# Altium schematic sheet PowerSupply-SCH_SH2_(02).SchDoc: SCHEMATIC
size 863 x 558 mm; DocumentNumber: NIR-Spec-2; SheetNumber: 2; SheetTotal: 2; PageSetup: Record=PageOptions|CenterHorizontal=True|CenterVertical=True|PrintScale=0.98|XCorrection=1.00|YCorrection=1.00|PrintKind=2|BorderSize=5000000|LeftOffset=0|BottomOffset=0|Orientation=2|PaperLength=1000|PaperWidth=1000|Scale=100|PaperSource=15|PrintQuality=1200|MediaType=1|DitherType=10|PaperKind=11 x 17|PrintScaleMode=1
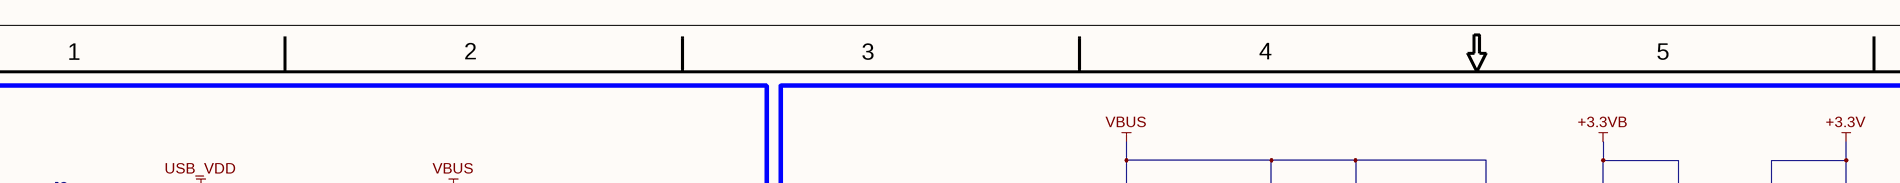
[diagram p0: PowerSupply-SCH_SH2_(02).SchDoc, top left]
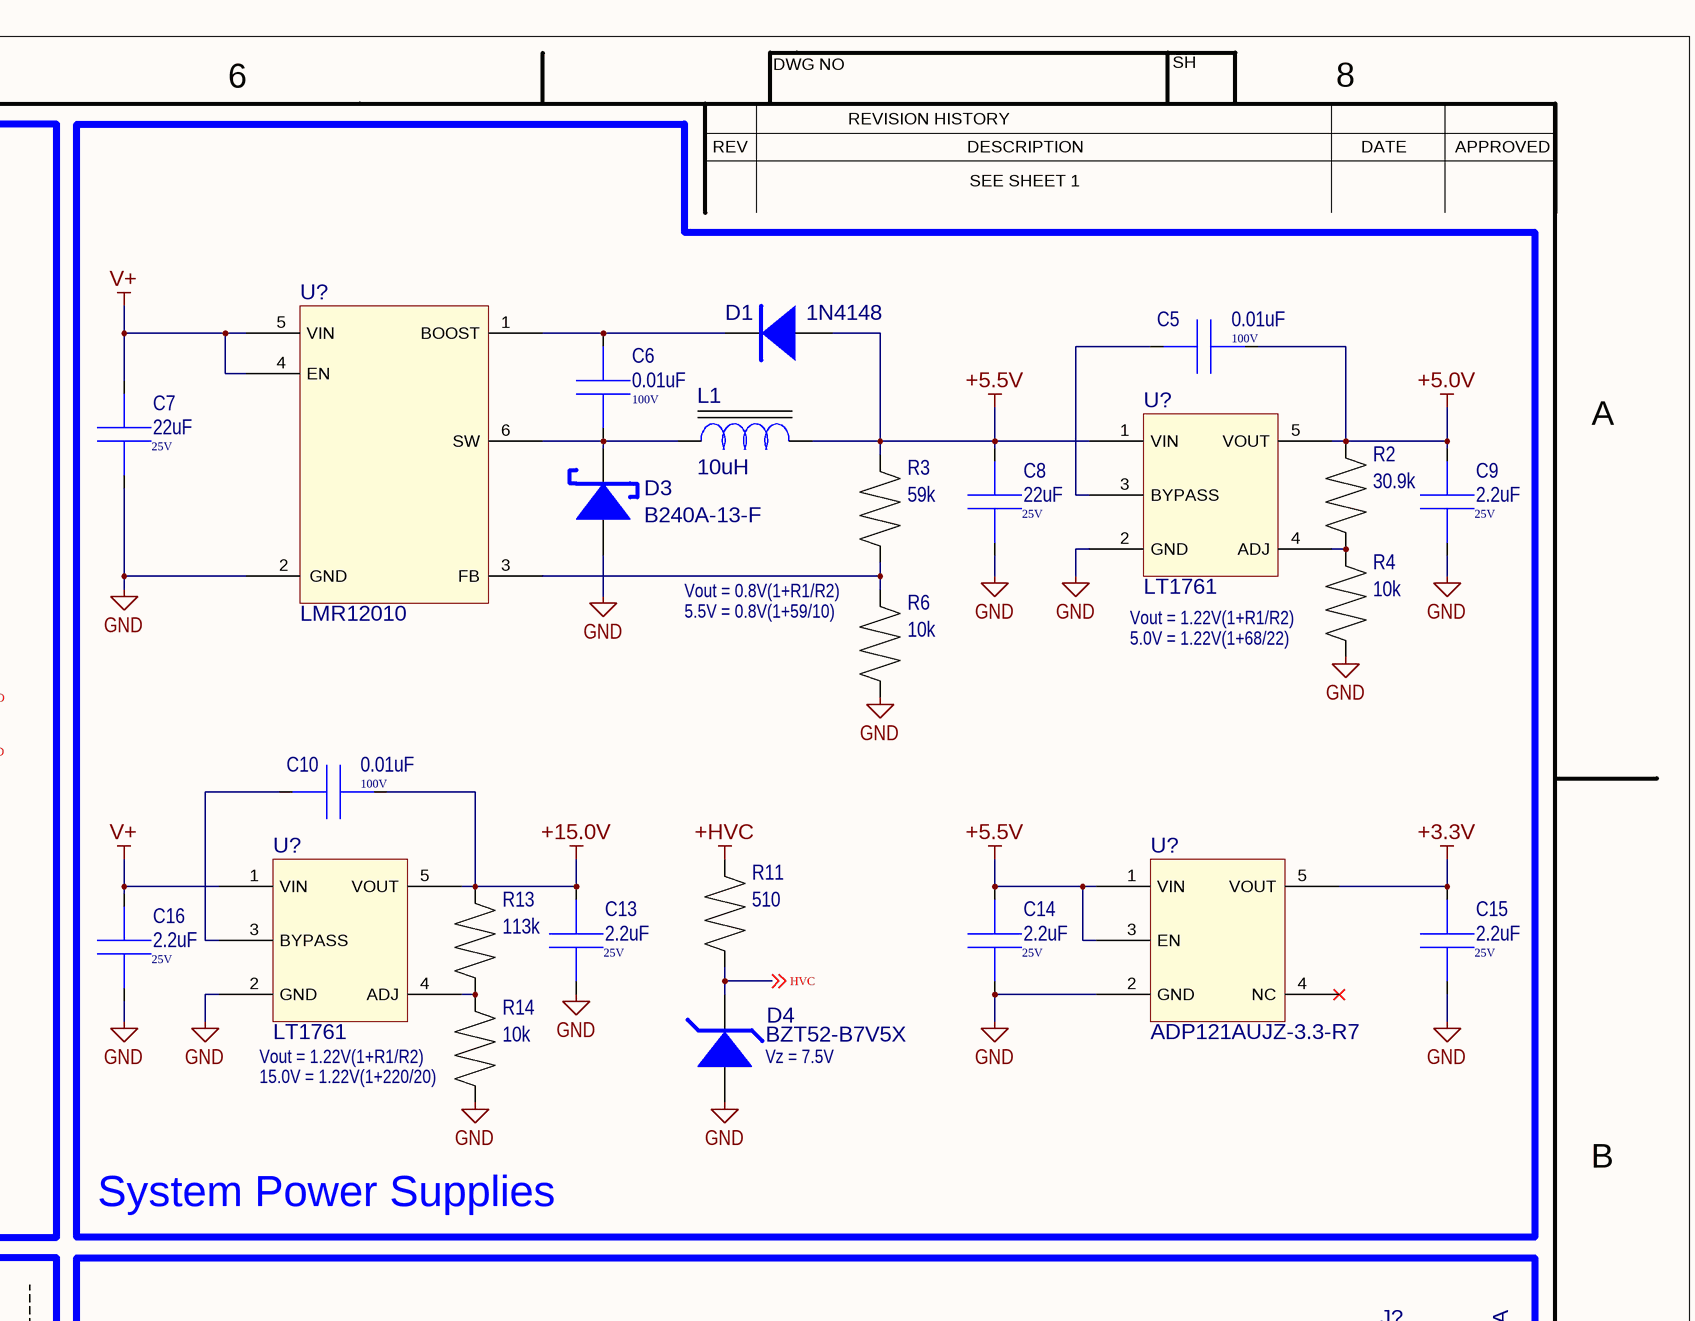
[diagram p1: PowerSupply-SCH_SH2_(02).SchDoc, top right]
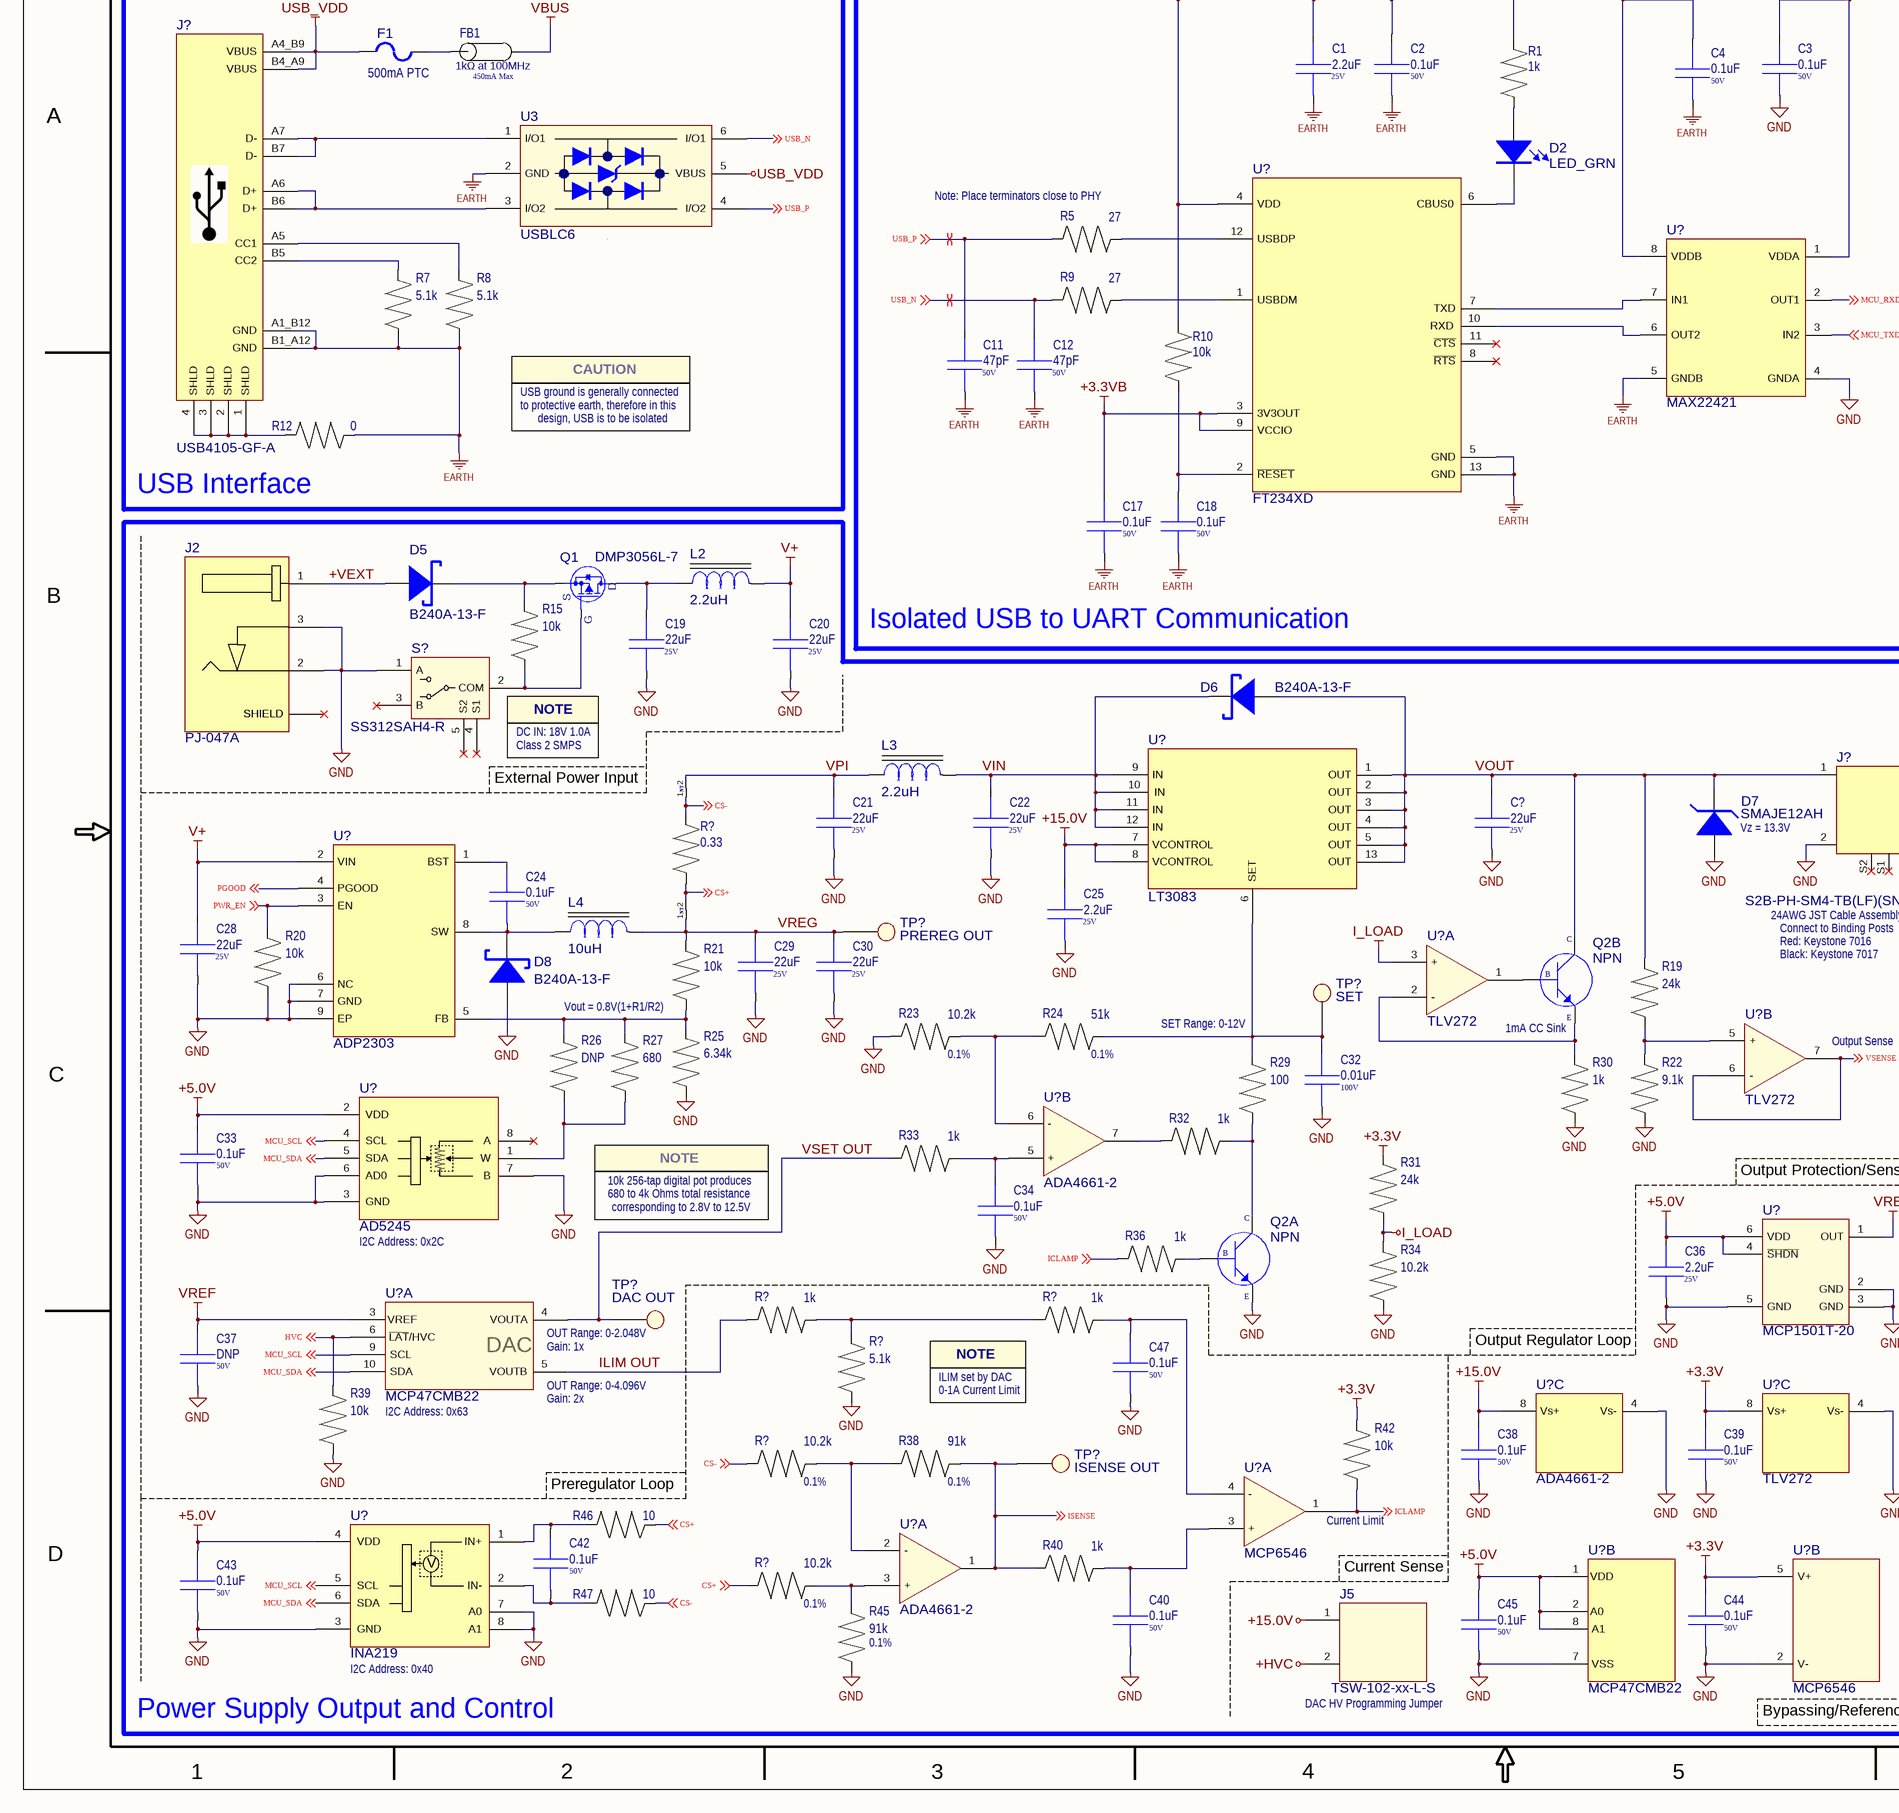
[diagram p2: PowerSupply-SCH_SH2_(02).SchDoc, bottom left]
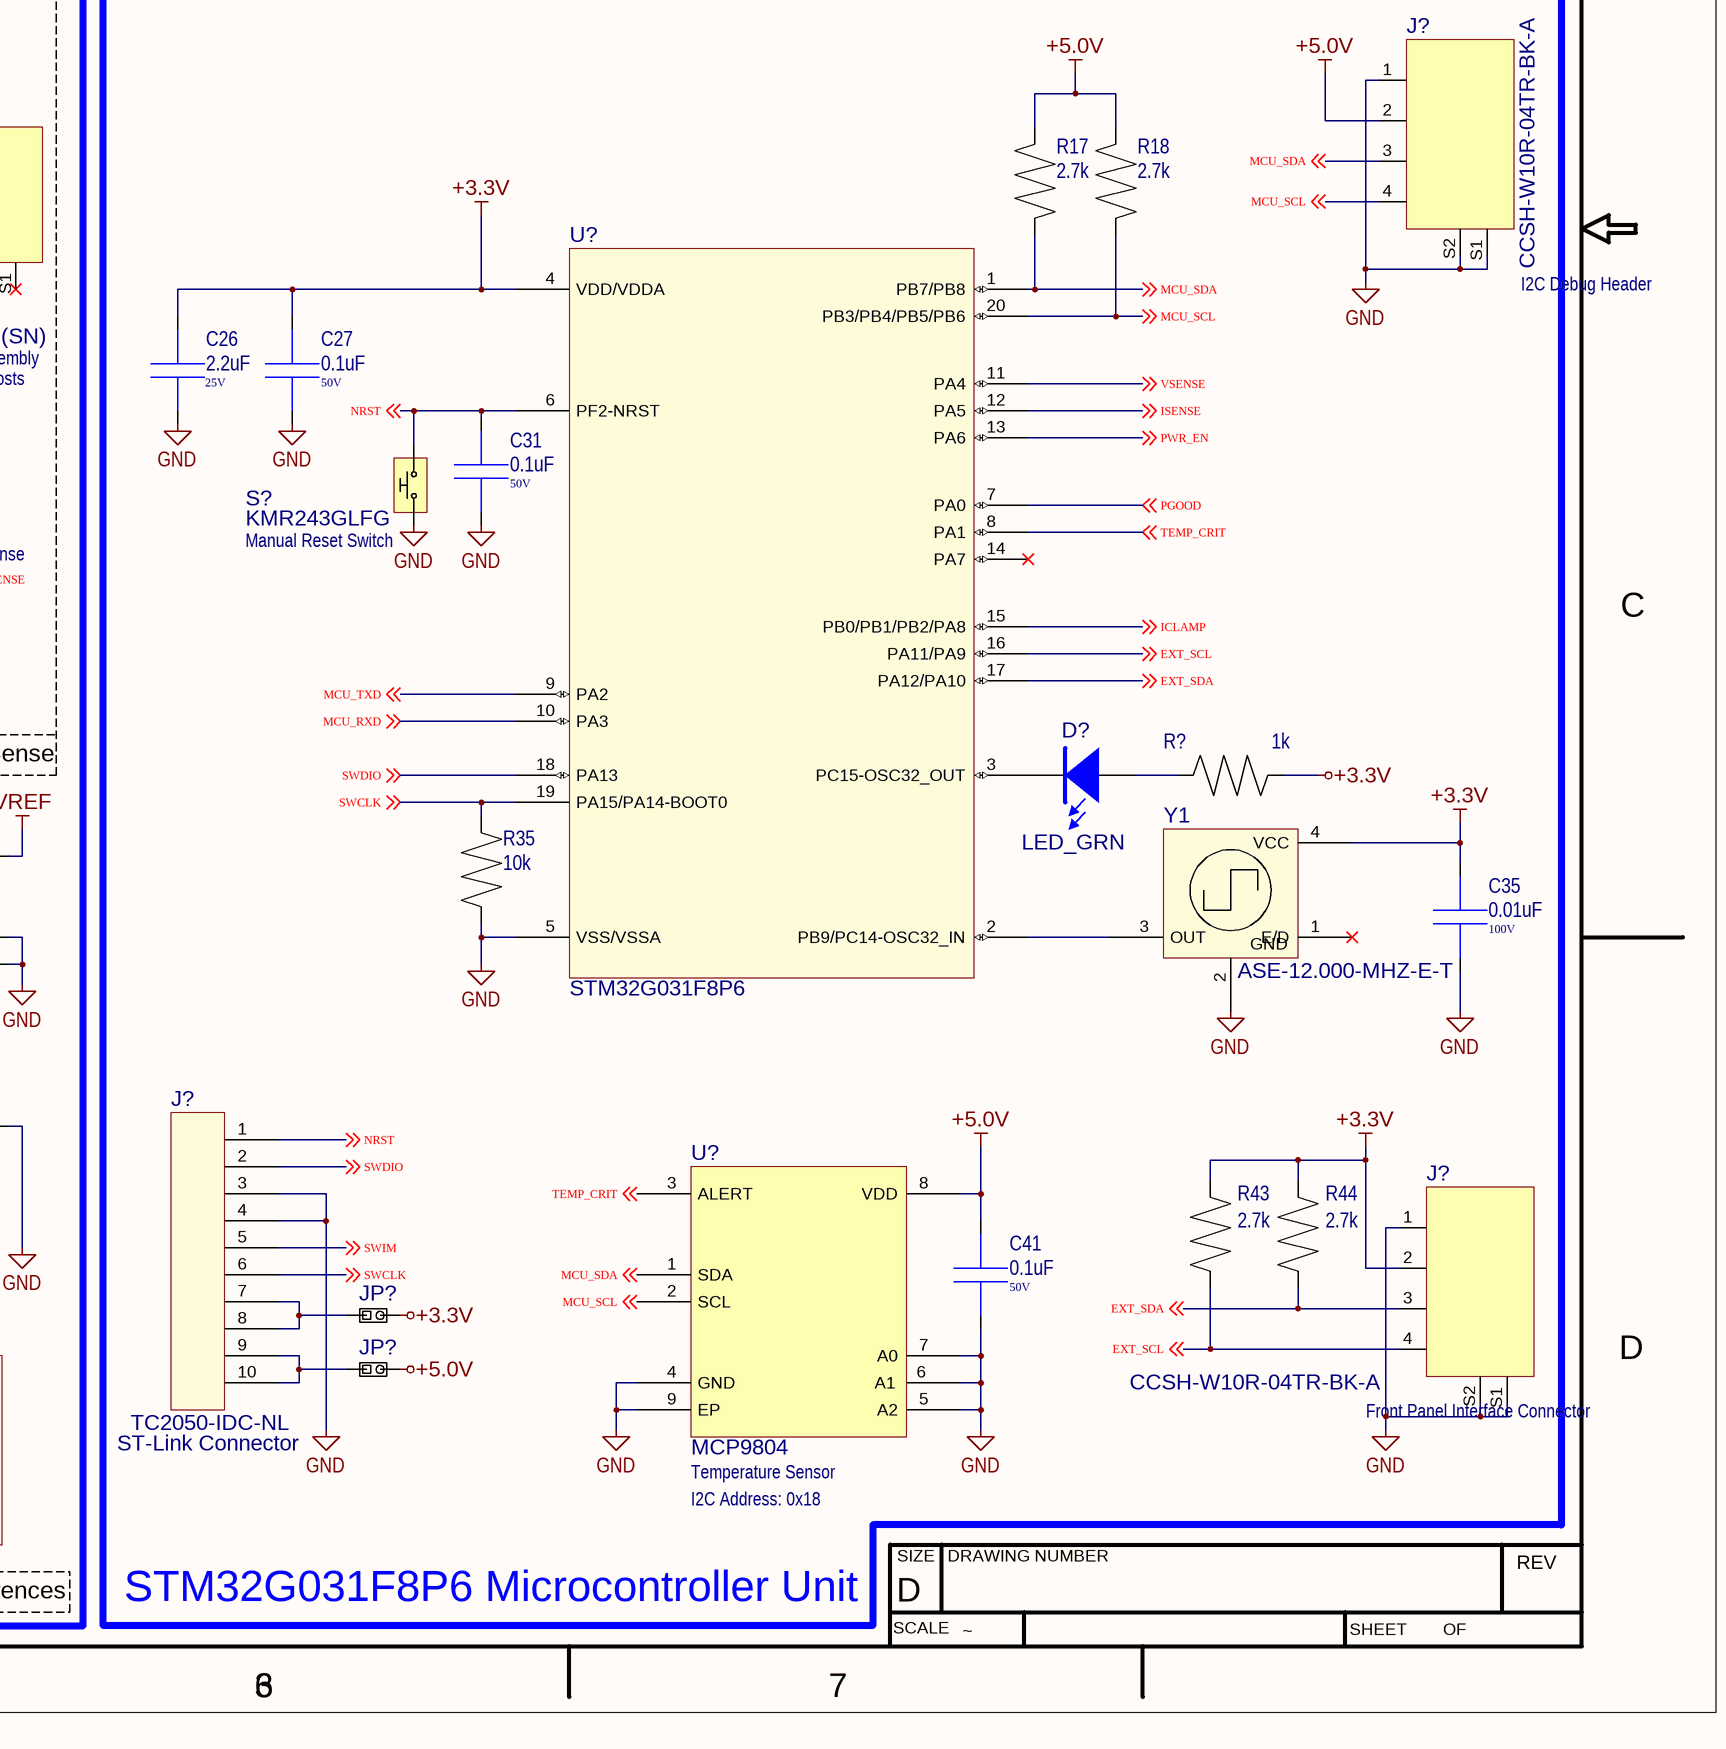
[diagram p3: PowerSupply-SCH_SH2_(02).SchDoc, bottom right]

## Parts
(Parts that share a designator on the sheet are numbered #1, #2 ... from top to bottom, then left to right.)
C1  2.2uF  Voltage: 25V  [0402]
C2  0.1uF  Voltage: 50V  [0402]
C3  0.1uF  Voltage: 50V  [0402]
C4  0.1uF  Voltage: 50V  [0402]
C5  0.01uF  Voltage: 100V  [0402]
C6  0.01uF  Voltage: 100V  [0402]
C7  22uF  Voltage: 25V  [0805]
C8  22uF  Voltage: 25V  [0805]
C9  2.2uF  Voltage: 25V  [0402]
C10  0.01uF  Voltage: 100V  [0402]
C11  47pF  Voltage: 50V  [0402]
C12  47pF  Voltage: 50V  [0402]
C13  2.2uF  Voltage: 25V  [0402]
C14  2.2uF  Voltage: 25V  [0402]
C15  2.2uF  Voltage: 25V  [0402]
C16  2.2uF  Voltage: 25V  [0402]
C17  0.1uF  Voltage: 50V  [0402]
C18  0.1uF  Voltage: 50V  [0402]
C19  22uF  Voltage: 25V  [0805]
C20  22uF  Voltage: 25V  [0805]
C21  22uF  Voltage: 25V  [0805]
C22  22uF  Voltage: 25V  [0805]
C24  0.1uF  Voltage: 50V  [0402]
C25  2.2uF  Voltage: 25V  [0402]
C26  2.2uF  Voltage: 25V  [0402]
C27  0.1uF  Voltage: 50V  [0402]
C28  22uF  Voltage: 25V  [0805]
C29  22uF  Voltage: 25V  [0805]
C30  22uF  Voltage: 25V  [0805]
C31  0.1uF  Voltage: 50V  [0402]
C32  0.01uF  Voltage: 100V  [0402]
C33  0.1uF  Voltage: 50V  [0402]
C34  0.1uF  Voltage: 50V  [0402]
C35  0.01uF  Voltage: 100V  [0402]
C36  2.2uF  Voltage: 25V  [0402]
C37  DNP  Voltage: 50V  [0402]
C38  0.1uF  Voltage: 50V  [0402]
C39  0.1uF  Voltage: 50V  [0402]
C40  0.1uF  Voltage: 50V  [0402]
C41  0.1uF  Voltage: 50V  [0402]
C42  0.1uF  Voltage: 50V  [0402]
C43  0.1uF  Voltage: 50V  [0402]
C44  0.1uF  Voltage: 50V  [0402]
C45  0.1uF  Voltage: 50V  [0402]
C47  0.1uF  Voltage: 50V  [0402]
C?  22uF  Voltage: 25V  [0805]
D1  1N4148  [SOD-323]
D2  LED_GRN  [0603_LED_Red]
D3  B240A-13-F  [SMA]
D4  BZT52-B7V5X  [SOD-123]
D5  B240A-13-F  [SMA]
D6  B240A-13-F  [SMA]
D7  SMAJE12AH  [SMA]
D8  B240A-13-F  [SMA]
D?  LED_GRN  [0603_LED_Red]
F1  500mA PTC  [0603]
FB1  Rated Current: 450mA Max  Impedance: 1kΩ at 100MHz  [0603]  (hidden comment: Ferrite_Bead)
J2  PJ-047A  [PJ-047A]
J5  TSW-102-xx-L-S  [TSW-102-xx-L-S]
J?#1  USB4105-GF-A  [USB4105-GF-A]
J?#2  CCSH-W10R-04TR-BK-A  [CCSH-W10R-04TR-BK-A]
J?#3  S2B-PH-SM4-TB(LF)(SN)  [S2B-PH-SM4-TB(LF)(SN)]
J?#4  TC2050-IDC-NL  [TC2050-IDC-NL-FP]  (no BOM)
J?#5  CCSH-W10R-04TR-BK-A  [CCSH-W10R-04TR-BK-A]
JP?#1  Solder Jumper  [SOLDER JUMPER]  (value not drawn)  (no BOM)
JP?#2  Solder Jumper  [SOLDER JUMPER]  (value not drawn)  (no BOM)
L1  10uH  [XFL4020-xxxMEx]
L2  2.2uH  [0806AZ]
L3  2.2uH  [0806AZ]
L4  10uH  [WURTH_WE-LHMI]
NT?#1  NT  [NETTIE]  (value not drawn)  (net tie, no BOM)
NT?#2  NT  [NETTIE]  (value not drawn)  (net tie, no BOM)
Q1  DMP3056L-7  [SOT-23]
Q2  NPN  [SOT-666]  (parts A,B of 2)
R1  1k  [0402]
R2  30.9k  [0402]
R3  59k  [0402]
R4  10k  [0402]
R5  27  [0402]
R6  10k  [0402]
R7  5.1k  [0402]
R8  5.1k  [0402]
R9  27  [0402]
R10  10k  [0402]
R11  510  [0603]
R12  0  [0402]
R13  113k  [0402]
R14  10k  [0402]
R15  10k  [0402]
R17  2.7k  [0402]
R18  2.7k  [0402]
R19  24k  [0402]
R20  10k  [0402]
R21  10k  [0402]
R22  9.1k  [0402]
R23  10.2k  [0402]
R24  51k  [0402]
R25  6.34k  [0402]
R26  DNP  [0402]
R27  680  [0402]
R29  100  [0402]
R30  1k  [0402]
R31  24k  [0402]
R32  1k  [0402]
R33  1k  [0402]
R34  10.2k  [0402]
R35  10k  [0402]
R36  1k  [0402]
R38  91k  [0402]
R39  10k  [0402]
R40  1k  [0402]
R42  10k  [0402]
R43  2.7k  [0402]
R44  2.7k  [0402]
R45  91k  [0402]
R46  10  [0402]
R47  10  [0402]
R?#1  0.33  [1206]
R?#2  1k  [0402]
R?#3  1k  [0402]
R?#4  1k  [0402]
R?#5  5.1k  [0402]
R?#6  10.2k  [0402]
R?#7  10.2k  [0402]
S?#1  SS312SAH4-R  [SW_SS312SAH4-R]
S?#2  KMR243GLFG  [KMR 2 Series]
TP?#1  PREREG OUT  [30-40 Drill]  (no BOM)
TP?#2  SET  [30-40 Drill]  (no BOM)
TP?#3  DAC OUT  [30-40 Drill]  (no BOM)
TP?#4  ISENSE OUT  [30-40 Drill]  (no BOM)
U3  USBLC6  [SOT-23-6_N]
U?#1  LT1761  [TSOT23-5]
U?#2  LMR12010  [TSOT-23-6]
U?#3  MAX22421  [SOIC-8]
U?#4  FT234XD  [DFN-12]
U?#5  LT1761  [TSOT23-5]
U?#6  ADP121AUJZ-3.3-R7  [TSOT23-5]
U?#7  LT3083  [DFN-12]
U?#8  ADP2303  [SOIC-8 EP]
U?#9  TLV272  [MSOP-8]  (part A of 3)
U?#10  TLV272  [MSOP-8]  (part B of 3)
U?#11  STM32G031F8P6  [TSSOP-20]
U?#12  AD5245  [TSOT-8]
U?#13  ADA4661-2  [MSOP-8]  (part B of 3)
U?#14  MCP1501T-20  [TSOT-23-6]
U?#15  MCP47CMB22  [MSOP-10]  (part A of 2)
U?#16  ADA4661-2  [MSOP-8]  (part C of 3)
U?#17  TLV272  [MSOP-8]  (part C of 3)
U?#18  MCP6546  [TSOT-23-5]  (part A of 2)
U?#19  MCP9804  [DFN-8_2x3]
U?#20  INA219  [SOIC-8]
U?#21  ADA4661-2  [MSOP-8]  (part A of 3)
U?#22  MCP47CMB22  [MSOP-10]  (part B of 2)
U?#23  MCP6546  [TSOT-23-5]  (part B of 2)
Y1  ASE-12.000-MHZ-E-T  [ASE-XXXXX-X-X-X]

## Blocks framed on the sheet
USB Interface: F1 FB1 J?#1 R7 R8 R12 U3
Isolated USB to UART Communication: C1-C4 C11 C12 C17 C18 D2 R1 R5 R9 R10 U?#3 U?#4
System Power Supplies: C5-C10 C13-C16 D1 D3 D4 L1 R2-R4 R6 R11 R13 R14 U?#1 U?#2 U?#5 U?#6
Power Supply Output and Control: C19-C22 C24 C25 C28-C30 C32-C34 C36-C40 C42-C45 C47 C? D5-D8 J2 J5 J?#3 L2-L4 NT?#1 NT?#2 Q1 Q2 R15 R19-R27 R29-R34 R36 R38-R40 R42 R45-R47 R?#1 R?#3-R?#7 S?#1 TP?#1-TP?#4 U?#7-U?#10 U?#12-U?#18 U?#20-U?#23
STM32G031F8P6 Microcontroller Unit: C26 C27 C31 C35 C41 D? J?#2 J?#4 J?#5 JP?#1 JP?#2 R17 R18 R35 R43 R44 R?#2 S?#2 U?#11 U?#19 Y1

## Nets
+3.3V: C3.2 C15.2 C26.2 C27.2 C35.2 C39.2 C44.2 J?#5.2 JP?#1.2 R31.2 R42.2 R43.2 R44.2 R?#2.2 U?#3.1(VDDA) U?#6.5(VOUT) U?#11.4(VDD/VDDA) U?#17.8(Vs+) U?#23.5(V+) Y1.4(VCC)
+3.3VB: C4.2 C17.2 U?#3.8(VDDB) U?#4.3(3V3OUT) U?#4.9(VCCIO)
+5.0V: C5.1 C9.2 C33.2 C36.2 C41.2 C43.2 C45.2 J?#2.2 JP?#2.2 R2.2 R17.2 R18.2 U?#1.5(VOUT) U?#12.2(VDD) U?#14.4(~{SHDN}) U?#14.6(VDD) U?#19.8(VDD) U?#20.4(VDD) U?#22.1(VDD) U?#22.2(A0) U?#22.8(A1)
+5.5V: C8.2 C14.2 D1.1(A) L1.2 R3.2 U?#1.1(VIN) U?#6.1(VIN) U?#6.3(EN)
+15.0V: C10.1 C13.2 C25.2 C38.2 J5.1 R13.2 U?#5.5(VOUT) U?#7.7(VCONTROL) U?#7.8(VCONTROL) U?#16.8(Vs+)
+HVC: J5.2 R11.2
EARTH: C1.1 C2.1 C4.1 C11.1 C12.1 C17.1 C18.1 J?#1.A1_B12(GND) J?#1.B1_A12(GND) R7.1 R8.1 R12.1 U3.2(GND) U?#3.5(GNDB) U?#4.5(GND) U?#4.13(GND)
GND: C3.1 C7.1 C8.1 C9.1 C13.1 C14.1 C15.1 C16.1 C19.1 C20.1 C21.1 C22.1 C25.1 C26.1 C27.1 C28.1 C29.1 C30.1 C31.1 C32.1 C33.1 C34.1 C35.1 C36.1 C37.1 C38.1 C39.1 C40.1 C41.1 C43.1 C44.1 C45.1 C47.1 C?.1 D3.1(A) D4.1(A) D7.1(A) D8.1(A) J2.2 J2.3 J?#2.1 J?#2.S1 J?#2.S2 J?#3.2 J?#4.3 J?#4.4 J?#5.1 J?#5.S1 J?#5.S2 Q2.1(E) R4.1 R6.1 R14.1 R20.1 R22.1 R23.1 R25.1 R30.1 R34.1 R35.2 R39.1 R45.1 R?#5.1 S?#1.1(A) S?#2.1 U?#1.2(GND) U?#2.2(GND) U?#3.4(GNDA) U?#5.2(GND) U?#6.2(GND) U?#8.6(NC) U?#8.7(GND) U?#8.9(EP) U?#11.5(VSS/VSSA) U?#12.3(GND) U?#12.6(AD0) U?#12.7(B) U?#14.2(GND) U?#14.3(GND) U?#14.5(GND) U?#16.4(Vs-) U?#17.4(Vs-) U?#19.4(GND) U?#19.5(A2) U?#19.6(A1) U?#19.7(A0) U?#19.9(EP) U?#20.3(GND) U?#20.7(A0) U?#20.8(A1) U?#22.7(VSS) U?#23.2(V-) Y1.2(GND)
I_LOAD: R31.1 R34.2 U?#9.3(+)
USB_VDD: F1.1 J?#1.A4_B9(VBUS) J?#1.B4_A9(VBUS) U3.5(VBUS)
V+: C7.2 C16.2 C20.2 C28.2 L2.2 U?#2.4(EN) U?#2.5(VIN) U?#5.1(VIN) U?#8.2(VIN)
VBUS: C1.2 C2.2 FB1.2 R1.2 R10.1 U?#4.4(VDD)
VREF: C37.2 U?#14.1(OUT) U?#15.3(VREF)
+VEXT: D5.1(A) J2.1
CS+: NT?#2.2 R46.1 R?#1.1 R?#7.1 ; off-sheet CS+
CS-: NT?#1.1 R47.1 R?#1.2 R?#6.1 ; off-sheet CS-
EXT_SCL: J?#5.4 R43.1 U?#11.16(PA11/PA9) ; off-sheet EXT_SCL
EXT_SDA: J?#5.3 R44.1 U?#11.17(PA12/PA10) ; off-sheet EXT_SDA
HVC: D4.2(K) R11.1 R39.2 U?#15.6(~{LAT}/HVC) ; off-sheet HVC
ICLAMP: R36.1 R42.1 U?#11.15(PB0/PB1/PB2/PA8) U?#18.1(OUT) ; off-sheet ICLAMP
ILIM OUT: R?#3.1 U?#15.5(VOUTB)
ISENSE: R38.2 R40.1 TP?#4.1 U?#11.12(PA5) U?#21.1(OUT) ; off-sheet ISENSE
MCU_RXD: U?#3.2(OUT1) U?#11.10(PA3) ; off-sheet MCU_RXD
MCU_SCL: J?#2.4 R18.1 U?#11.20(PB3/PB4/PB5/PB6) U?#12.4(SCL) U?#15.9(SCL) U?#19.2(SCL) U?#20.5(SCL) ; off-sheet MCU_SCL
MCU_SDA: J?#2.3 R17.1 U?#11.1(PB7/PB8) U?#12.5(SDA) U?#15.10(SDA) U?#19.1(SDA) U?#20.6(SDA) ; off-sheet MCU_SDA
MCU_TXD: U?#3.3(IN2) U?#11.9(PA2) ; off-sheet MCU_TXD
NRST: C31.2 J?#4.1 S?#2.2 U?#11.6(PF2-NRST) ; off-sheet NRST
PGOOD: U?#8.4(PGOOD) U?#11.7(PA0) ; off-sheet PGOOD
PWR_EN: R20.2 U?#8.3(EN) U?#11.13(PA6) ; off-sheet PWR_EN
SWCLK: J?#4.6 R35.1 U?#11.19(PA15/PA14-BOOT0) ; off-sheet SWCLK
SWDIO: J?#4.2 U?#11.18(PA13) ; off-sheet SWDIO
SWIM: J?#4.5 ; off-sheet SWIM
TEMP_CRIT: U?#11.8(PA1) U?#19.3(ALERT) ; off-sheet TEMP_CRIT
USB_N: C12.2 R9.1 U3.6(I/O1) ; off-sheet USB_N
USB_P: C11.2 R5.1 U3.4(I/O2) ; off-sheet USB_P
VIN: C22.2 D6.2(K) L3.2 U?#7.9(IN) U?#7.10(IN) U?#7.11(IN) U?#7.12(IN)
VOUT: C?.2 D6.1(A) D7.2(K) J?#3.1 Q2.3(C) R19.2 U?#7.1(OUT) U?#7.2(OUT) U?#7.3(OUT) U?#7.4(OUT) U?#7.5(OUT) U?#7.13(OUT)
VPI: C21.2 L3.1 NT?#1.2
VREG: C29.2 C30.2 L4.2 NT?#2.1 R21.2 TP?#1.1
VSENSE: U?#10.6(-) U?#10.7(OUT) U?#11.11(PA4) ; off-sheet VSENSE
VSET OUT: R33.1 TP?#3.1 U?#15.4(VOUTA)
NetC5_2: C5.2 U?#1.3(BYPASS)
NetC6_1: C6.1 D3.2(K) L1.1 U?#2.6(SW)
NetC6_2: C6.2 D1.2(K) U?#2.1(BOOST)
NetC10_2: C10.2 U?#5.3(BYPASS)
NetC18_2: C18.2 R10.2 U?#4.2(~{RESET})
NetC19_2: C19.2 L2.1 Q1.2(D)
NetC24_1: C24.1 D8.2(K) L4.1 U?#8.8(SW)
NetC24_2: C24.2 U?#8.1(BST)
NetC32_2: C32.2 R24.2 R29.2 TP?#2.1 U?#7.6(SET)
NetC34_2: C34.2 R33.2 U?#13.5(+)
NetC40_2: C40.2 R40.2 U?#18.3(+)
NetC42_1: C42.1 R47.2 U?#20.2(IN-)
NetC42_2: C42.2 R46.2 U?#20.1(IN+)
NetC47_2: C47.2 R?#4.2 U?#18.4(-)
NetD2_1: D2.1(A) R1.1
NetD2_2: D2.2(K) U?#4.6(CBUS0)
NetD5_2: D5.2(K) Q1.3(S) R15.2
NetD?_1: D?.1(A) R?#2.1
NetD?_2: D?.2(K) U?#11.3(PC15-OSC32_OUT)
NetF1_2: F1.2 FB1.1
NetJ2_4: J2.4(SHIELD) J2.5(SHIELD)
NetJ?#1_1: J?#1.1(SHLD) J?#1.2(SHLD) J?#1.3(SHLD) J?#1.4(SHLD) R12.2
NetJ?#1_A5: J?#1.A5(CC1) R8.2
NetJ?#1_A6: J?#1.A6(D+) J?#1.B6(D+) U3.3(I/O2)
NetJ?#1_A7: J?#1.A7(D-) J?#1.B7(D-) U3.1(I/O1)
NetJ?#1_B5: J?#1.B5(CC2) R7.2
NetJ?#4_7: J?#4.7 J?#4.8 JP?#1.1
NetJ?#4_9: J?#4.9 J?#4.10 JP?#2.1
NetQ1_1: Q1.1(G) R15.1 S?#1.2(COM)
NetQ2_2: Q2.2(B) R36.2
NetQ2_4: Q2.4(E) R30.2 U?#9.2(-)
NetQ2_5: Q2.5(B) U?#9.1(OUT)
NetQ2_6: Q2.6(C) R29.1 R32.2
NetR2_1: R2.1 R4.2 U?#1.4(ADJ)
NetR3_1: R3.1 R6.2 U?#2.3(FB)
NetR5_2: R5.2 U?#4.12(USBDP)
NetR9_2: R9.2 U?#4.1(USBDM)
NetR13_1: R13.1 R14.2 U?#5.4(ADJ)
NetR19_1: R19.1 R22.2 U?#10.5(+)
NetR21_1: R21.1 R25.2 R26.2 R27.2 U?#8.5(FB)
NetR23_2: R23.2 R24.1 U?#13.6(-)
NetR26_1: R26.1 R27.1 U?#12.1(W)
NetR32_1: R32.1 U?#13.7(OUT)
NetR38_1: R38.1 R?#6.2 U?#21.2(-)
NetR45_2: R45.2 R?#7.2 U?#21.3(+)
NetR?#3_2: R?#3.2 R?#4.1 R?#5.2
NetU?#3_6: U?#3.6(OUT2) U?#4.10(RXD)
NetU?#3_7: U?#3.7(IN1) U?#4.7(TXD)
NetU?#11_2: U?#11.2(PB9/PC14-OSC32_IN) Y1.3(OUT)

Not connected (* = marked no-connect by the designer): J?#3 S1* S2*; S?#1 3(B)* 4(S1)* 5(S2)*; U?#4 8(~{RTS})* 11(~{CTS})*; U?#6 4(NC)*; U?#11 14(PA7)*; U?#12 8(A)*; Y1 1(E/D)*

## Layout directives
differential pair: USB_N, USB_P

## Notes on the sheet
- 1
- 2
- 3
- 4
- 5
- 6
- DWG NO
- REVISION HISTORY
- SH
- 8
- REV
- DESCRIPTION
- SEE SHEET 1
- DATE
- APPROVED
- A
- Note: Place terminators close to PHY
- (near R6) Vout = 0.8V(1+R1/R2)
- (near R6) 5.5V = 0.8V(1+59/10)
- (near R4) Vout = 1.22V(1+R1/R2)
- (near R4) 5.0V = 1.22V(1+68/22)
- USB ground is generally connected
- to protective earth, therefore in this
- CAUTION
- design, USB is to be isolated
- (near R14) Vout = 1.22V(1+R1/R2)
- (near D4) Vz = 7.5V
- (near R14) 15.0V = 1.22V(1+220/20)
- B
- NOTE
- (near S?#1) DC IN: 18V 1.0A
- (near S?#1) Class 2 SMPS
- External Power Input
- Vz = 13.3V
- (near J?#2) I2C Debug Header
- 24AWG JST Cable Assembly
- Connect to Binding Posts
- Red: Keystone 7016
- Black: Keystone 7017
- (near R21) Vout = 0.8V(1+R1/R2)
- (near R23) 0.1%
- (near R24) 0.1%
- (near R29) SET Range: 0-12V
- 1mA CC Sink
- (near U?#10) Output Sense
- (near S?#2) Manual Reset Switch
- C
- 10k 256-tap digital pot produces
- 680 to 4k Ohms total resistance
- Output Protection/Sense
- corresponding to 2.8V to 12.5V
- (near U?#12) I2C Address: 0x2C
- OUT Range: 0-2.048V
- (near U?#15) Gain: 1x
- Output Regulator Loop
- (near U?#15) OUT Range: 0-4.096V
- (near U?#15) Gain: 2x
- ILIM set by DAC
- 0-1A Current Limit
- I2C Address: 0x63
- Preregulator Loop
- (near R?#6) 0.1%
- (near R38) 0.1%
- Current Limit
- D
- Current Sense
- (near R?#7) 0.1%
- (near J?#4) ST-Link Connector
- Front Panel Interface Connector
- (near U?#20) I2C Address: 0x40
- (near R45) 0.1%
- I2C Address: 0x18
- (near U?#19) Temperature Sensor
- DAC HV Programming Jumper
- Bypassing/References
- SIZE
- DRAWING NUMBER
- SCALE
- ~
- SHEET        OF
- 7
- (in symbol INA219) V
- (in symbol MCP47CMB22, part A) DAC

## Library data of the parts
C1 C9 C13-C16 C25 C26 C36 = CAP: Multilayer Ceramic Capacitors MLCC - SMD/SMT 2.2UF 25V 10% 0402; Part Number: GRM155R61E225KE11D; Manufacturer: Murata Electronics
  C1 C26: ClassName: STM32 MCU
  C9: ClassName: 5.0V Regulator
  C13 C16: ClassName: Analog VDD
  C14 C15: ClassName: 3.3V Regulator
  C25 C36: ClassName: Power Supply Output and Control
C2-C4 C17 C18 C24 C27 C31 C33 C37-C45 C47 = CAP: CAP CER 0.1UF 50V X7R 0402; Part Number: UMK105B7104KVHF; Manufacturer: Taiyo Yuden
  C2-C4 C17 C18: ClassName: USB to UART PHY
  C24 C37-C40 C42-C45 C47: ClassName: Power Supply Output and Control
  C27 C31 C41: ClassName: STM32 MCU
  C33: ClassName: Output Preregulator
C5 C6 C10 C32 C35 = CAP: CAP CER 0.01UF 100V X7R 0402; Part Number: HMR105B7103MV-F; Manufacturer: Taiyo Yuden
  C5: ClassName: 5.0V Regulator
  C6: ClassName: System Power Preregulator
  C10: ClassName: Analog VDD
  C32: ClassName: Power Supply Output and Control
  C35: ClassName: STM32 MCU
C7 C8 C19-C22 C28-C30 C? = CAP: CAP CER 22UF 25V X5R 0805; Part Number: CL21A226MAYNNNE; Manufacturer: Samsung Electro-Mechanics
  C7: ClassName: System Power Preregulator
  C8: ClassName: 5.0V Regulator
  C19 C20: ClassName: Power Input
  C21 C22 C29 C30 C?: ClassName: Power Supply Output and Control
  C28: ClassName: Output Preregulator
C11 C12 = CAP: Multilayer Ceramic Capacitors MLCC - SMD/SMT 50Volt 47pF X7R 0402 10% AEC-Q200; Part Number: C0402C470K5RACAUTO; Manufacturer: KEMET; ClassName: USB to UART PHY
C34 = CAP: CAP CER 0.1UF 50V X7R 0603; Part Number: C0603C104K5RAC3121; Manufacturer: KEMET; ClassName: Power Supply Output and Control
D1 = DIODE: Diodes - General Purpose, Power, Switching 100V, 0.15A, Switching Diode & Array; Part Number: 1N4148WS-G RVG; Manufacturer: Taiwan Semiconductor; ClassName: System Power Preregulator
D2 D? = LED_Red: Standard LEDs - SMD HE Red 645 nm Water Clear; Part Number: SM0603HCL; Manufacturer: Bivar
  D2: ClassName: USB to UART PHY
  D?: ClassName: STM32 MCU
D3 D5 D6 D8 = DIODE_SCHOTTKY: DIODE SCHOTTKY 40V 2A SMA; Manufacturer: Diodes Incorporated; Part Number: B240A-13-F
  D3: ClassName: System Power Preregulator
  D5: ClassName: Power Input
  D6: ClassName: Power Supply Output and Control
  D8: ClassName: Output Preregulator
D4 = DIODE_ZENER: DIODE ZENER 7.5V 590MW SOD123; Manufacturer: Nexperia USA Inc.; Part Number: BZT52-B7V5X; ClassName: HVC
D7 = DIODE_ZENER: TVS DIODE 12VWM UNI; Manufacturer: Eaton - Electronics Division; Part Number: SMAJE12AH; ClassName: Power Supply Output and Control
F1 = FUSE: 500mA PTC Fuse; Part Number: MF-FSMF050X-2; Manufacturer: Bourns; ClassName: USB Interface
FB1 = Ferrite_Bead: Ferrite Beads 1000 OHM 25%; Manufacturer: Murata Electronics; Part Number: BLM18AG102SH1D; ClassName: USB Interface
J2 = PJ-047A: CON PWR JCK 2.0 X 6.0MM W/SHLD 2.5A; Manufacturer: CUI Inc; Part Number: PJ-047A; ClassName: Power Input
J5 = TSW-102-xx-L-S: CONN MALE HEADER 2 POS .100" T/H GOLD UNSHROUDED; Manufacturer: Samtec; Part Number: TSW-102-xx-L-S; ClassName: HVC
J?#1 = USB4105-GF-A: CONN RCP USB2.0 TYP C 24P SMD RA; Manufacturer: GCT; Part Number: USB4105-GF-A
J?#2 J?#5 = CCSH-W10R-04TR-BK-A: JST 4 PIN SMT CONN; Manufacturer: JST; Part Number: CCSH-W10R-04TR-BK-A
J?#3 = S2B-PH-SM4-TB(LF)(SN): CONN HEADER SMD R/A 2POS 2MM; Manufacturer: JST Sales America Inc.; Part Number: S2B-PH-SM4-TB(LF)(SN)
J?#4 = TC2050-IDC-NL: CBL PLUG-OF-NAILS 10-PIN; Manufacturer: Tag-Connect LLC; Part Number: TC2050-IDC-NL
JP?#1 JP?#2 = SolderJumper_Single: Solder Jumper Single 0.5mm Pitch
L1 = SHIELDED_INDUCTOR: Fixed Inductors 10uH 0.85A 4x4x2.0mm; Part Number: VLCF4020T-100MR85; Manufacturer: TDK; ClassName: System Power Preregulator
L2 L3 = SHIELDED_INDUCTOR: FIXED IND 2.2UH 1.8A 139MOHM SMD; Part Number: CIGT201610LH2R2MNE; Manufacturer: Samsung Electro-Mechanics
  L2: ClassName: Power Input
  L3: ClassName: Power Supply Output and Control
L4 = SHIELDED_INDUCTOR: FIXED IND 10UH 5.2A 30 MOHM SMD; Part Number: 74437368100; Manufacturer: Würth Elektronik; ClassName: Output Preregulator
NT?#1 NT?#2 = NetTie: Net Tie
Q1 = MOSFET_P: MOSFET P-CH 30V 4.3A SOT23; Manufacturer: Diodes Incorporated; Part Number: DMP3056L-7; ClassName: Power Input
Q2 = NPN_DUAL: TRANS 2NPN 45V 0.1A SOT666; Manufacturer: Nexperia USA; Part Number: BCM847BV,115; ClassName: Power Supply Output and Control
R1 R30 R32 R33 R40 R?#3 R?#4 = RES: Thick Film Resistors - SMD Resistor 0402 1k 1% 63mW TC100; Part Number: CR0402AFX-1001GLF; Manufacturer: Bourns
  R1: ClassName: USB to UART PHY
  R30 R32 R33 R40 R?#3 R?#4: ClassName: Power Supply Output and Control
R2 = RES: Thick Film Resistors - SMD 0402 30.9Kohms 1% AEC-Q200; Part Number: ERJ-2RKF3092X; Manufacturer: Panasonic; ClassName: 5.0V Regulator
R3 = RES: Thick Film Resistors - SMD 1/16watt 59K ohms 1% Commercial Use; Part Number: CRCW040259K0FKEDC; Manufacturer: Vishay / Dale; ClassName: System Power Preregulator
R4 R6 R10 R14 R15 R20 R21 R26 R35 R39 R42 = RES: Thick Film Resistors - SMD 10K OHM 1%; Part Number: CR0402-FX-1002GLF; Manufacturer: Bourns
  R4: ClassName: 5.0V Regulator
  R6: ClassName: System Power Preregulator
  R10: ClassName: USB to UART PHY
  R14: ClassName: Analog VDD
  R15: ClassName: Power Input
  R20 R21 R26: ClassName: Output Preregulator
  R35: ClassName: STM32 MCU
  R39 R42: ClassName: Power Supply Output and Control
R5 R9 = RES: Thick Film Resistors - SMD 0402 27.0ohms 1% Tol AEC-Q200; Part Number: ERJ-2RKF27R0X; Manufacturer: Panasonic; ClassName: USB to UART PHY
R7 R8 R?#5 = RES: Thick Film Resistors - SMD 1/16watt 5.1Kohms 1%; Part Number: CRCW04025K10FKED; Manufacturer: Vishay / Dale
  R7 R8: ClassName: USB Interface
  R?#5: ClassName: Power Supply Output and Control
R11 = RES: Thick Film Resistors - SMD 510 Ohms 100mW 0603 1%; Part Number: RC0603FR-07510RL; Manufacturer: YAGEO; ClassName: HVC
R12 = RES: Thick Film Resistors - SMD 1/16watt 0ohm Commercial Use; Part Number: CRCW04020000Z0EDC; Manufacturer: Vishay / Dale; ClassName: USB Interface
R13 = RES: Thick Film Resistors - SMD 1/16 Watt 113K ohms 1%; Part Number: CRCW0402113KFKED; Manufacturer: Vishay / Dale; ClassName: Analog VDD
R17 R18 R43 R44 = RES: Thick Film Resistors - SMD 0402 2.7Kohms 1% AEC-Q200; Part Number: ERJ-2RKF2701X; Manufacturer: Panasonic; ClassName: STM32 MCU
R19 R31 = RES: Thin Film Resistors - SMD 1/16W 24K ohm 0.1% 25ppm; Part Number: RT0402BRD0724KL; Manufacturer: YAGEO; ClassName: Power Supply Output and Control
R22 = RES: Thin Film Resistors - SMD 0402 1/16W 9.1Kohms; Part Number: ERA-2AEB912X; Manufacturer: Panasonic; ClassName: Power Supply Output and Control
R23 R34 R?#6 R?#7 = RES: Thin Film Resistors - SMD 0402 10.2Kohms 0.1% .063W 15ppm AEC-Q200; Part Number: ERA-2APB1022X; Manufacturer: Panasonic; ClassName: Power Supply Output and Control
R24 = RES: Thin Film Resistors - SMD 0402 1/16W 51Kohms 0.1%; Part Number: ERA-2AEB513X; Manufacturer: Panasonic; ClassName: Power Supply Output and Control
R25 = RES: Thick Film Resistors - SMD 0402 1% 6.34Kohm Anti-Sulfur AEC-Q200; Part Number: ERJ-U02F6341X; Manufacturer: Panasonic; ClassName: Output Preregulator
R27 = RES: Thick Film Resistors - SMD 680 OHM 1%; Part Number: CR0402-FX-6800GLF; Manufacturer: Bourns; ClassName: Output Preregulator
R29 = RES: Thick Film Resistors - SMD 0402 100ohms 1% AEC-Q200; Part Number: ERJ-2RKF1000X; Manufacturer: Panasonic; ClassName: Power Supply Output and Control
R36 R?#2 = RES: Thick Film Resistors - SMD ResA 0402 1k 1% 63mW TC100; Part Number: CR0402AFX-1001GLF; Manufacturer: Bourns
  R36: ClassName: Power Supply Output and Control
  R?#2: ClassName: STM32 MCU
R38 R45 = RES: RES SMD 91K OHM 0.1% 1/16W 0402; Part Number: ERA-2AEB913X; Manufacturer: Panasonic; ClassName: Power Supply Output and Control
R46 R47 = RES: Thick Film Resistors - SMD 0402 10ohm 1% Anti Surge AEC-Q200; Part Number: ESR01MZPF10R0; Manufacturer: ROHM Semiconductor; ClassName: Power Supply Output and Control
R?#1 = RES: RES 0.33 OHM 1% 1/4W 1206; Part Number: ERJ-8RQFR33V; Manufacturer: Panasonic Electronic Components; ClassName: Power Supply Output and Control
S?#1 = SS312SAH4-R: SWITCH SLIDE SPDT 0.4VA 28V; Manufacturer: NKK Switches; Part Number: SS312SAH4-R
S?#2 = KMR 2 Series: SWITCH TACTILE SPST-NO 0.01A 32V; Manufacturer: C&K; Part Number: KMR243GLFG
TP?#1-TP?#4 = TEST-POINT
U3 = USBLC6-2SC6: IC ESD PROTECTION LO CAP SOT23-6; Manufacturer: STMicroelectronics; Part Number: USBLC6-2SC6; ClassName: USB Interface
U?#1 U?#5 = LT1761ES5-BYP#TRMPBF: IC REG LDO ADJ 0.1A TSOT23-5; Manufacturer: Linear Technology; Part Number: LT1761ES5-BYP#TRMPBF
U?#2 = LMR12010: IC REG BUCK ADJ 1A TSOT23-6; Manufacturer: Texas Instruments; Part Number: LMR12010XMKE/NOPB
U?#3 = MAX22421: 2-CH 3KVRMS DIGITAL ISOLATOR; Part Number: MAX22421BASA+; Manufacturer: Maxim Integrated
U?#4 = FT234XD: IC USB SERIAL BASIC UART 12DFN; Part Number: FT234XD-R; Manufacturer: FTDI
U?#6 = ADP122AxxZ-xxx-R7: IC REG LINEAR 3.3V 150MA TSOT5; Manufacturer: Analog Devices; Part Number: ADP121AUJZ-3.3-R7
U?#7 = LT3083: Linear Voltage Regulator IC Positive Adjustable 1 Output 3A 12-DFN (4x4); Manufacturer: Analog Devices Inc.; Part Number: LT3083EDF#PBF
U?#8 = ADP2303: IC REG BUCK ADJUSTABLE 3A 8SOIC; Part Number: ADP2303ARDZ; Manufacturer: Analog Devices Inc.
U?#9 U?#10 U?#17 = AD8072: IC CMOS 2 CIRCUIT 8MSOP; Part Number: TLV272CM8-13; Manufacturer: Diodes Incorporated
U?#11 = STM32G031FxP6: IC MCU 32BIT 64KB FLASH 20TSSOP; Manufacturer: STMicroelectronics; Part Number: STM32G031F8P6
U?#12 = AD5245: IC DGTL POT xKOHM 256TAP SOT23-8; Part Number: AD5245BRJZ10-R2; Manufacturer: Analog Devices Inc.
U?#13 U?#16 U?#21 = AD8072: IC CMOS 2 CIRCUIT 8MSOP; Part Number: AD8072ARMZ; Manufacturer: Analog Devices Inc.
U?#14 = MCP1501: IC VREF SERIES 0.1% SOT23-6; Manufacturer: Microchip Technology; Part Number: MCP1501T-20E/CHY
U?#15 U?#22 = MCP47CMB22: IC DAC 12BIT DUAL V-OUT 10MSOP; Manufacturer: Microchip Technology; Part Number: MCP47CMB22-E/UN
U?#18 U?#23 = MCP6546: IC COMP 1.6V SGL O-D SOT23-5; Manufacturer: Microchip Technology; Part Number: MCP6546T-E/OT
U?#19 = MCP9804: SENSOR DIGITAL -40C-125C 8DFN; Manufacturer: Microchip Technology; Part Number: MCP9804T-E/MC
U?#20 = INA219: IC CURRENT MONITOR 1% SOT23-8; Manufacturer: Texas Instruments; Part Number: INA219AIDCNR
Y1 = ASE-XXXXX-MHZ-X-X: OSC XO 12.000MHZ CMOS SMD; Manufacturer: Abracon; Part Number: ASE-12.000-MHZ-E-T; ClassName: STM32 MCU